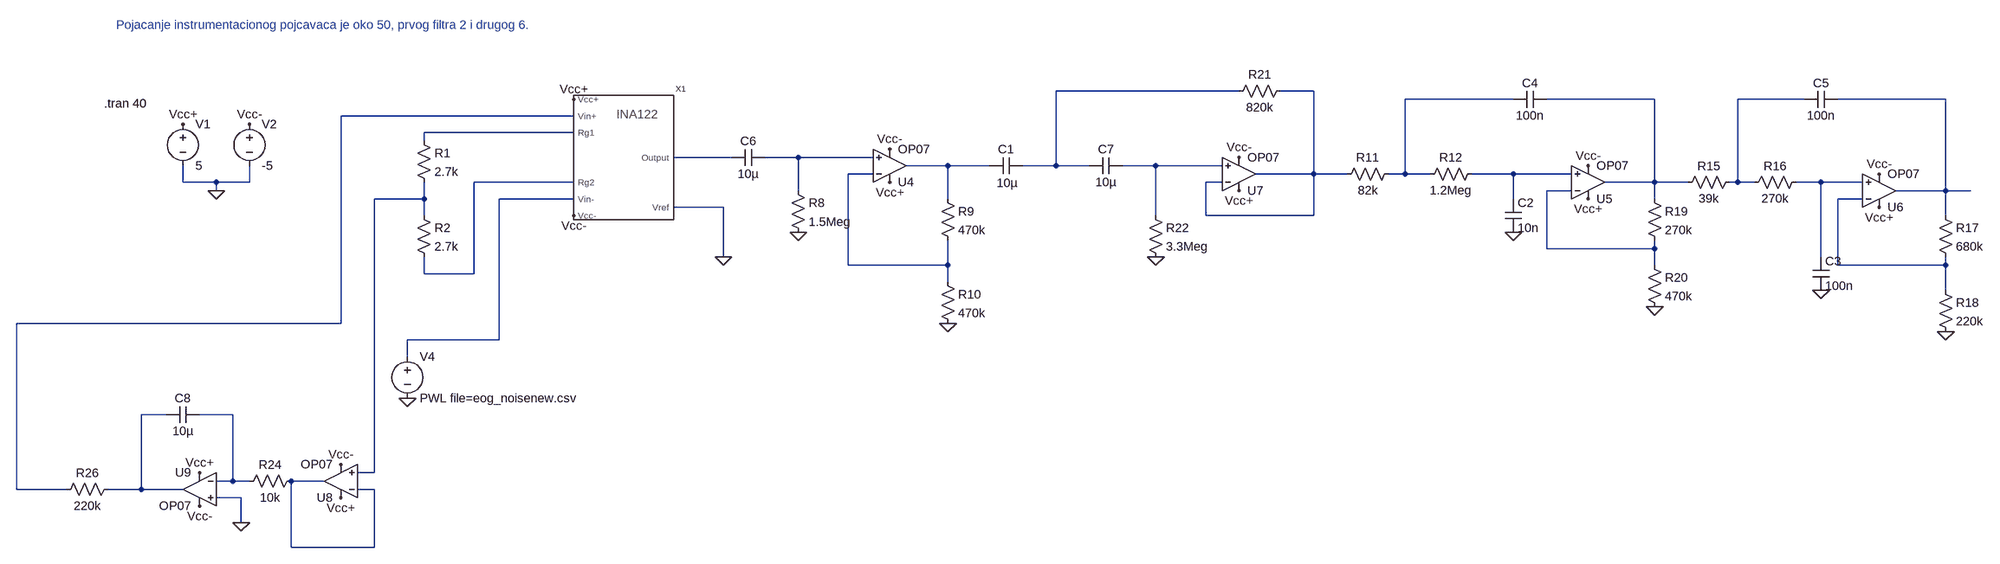
[diagram p0: schematic finalna_sema.asc]
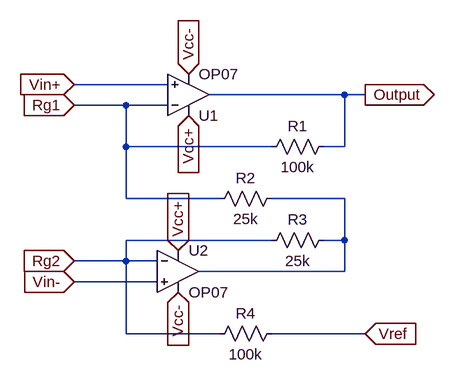
[diagram p1: sub-circuit ina122.asc]
finalna_sema.asc, the LTspice schematic file:
Version 4
SHEET 1 3168 1024
WIRE 1728 128 1376 128
WIRE 1872 128 1808 128
WIRE 2256 144 2048 144
WIRE 2528 144 2320 144
WIRE 2816 144 2688 144
WIRE 3088 144 2880 144
WIRE 448 176 0 176
WIRE 448 208 160 208
WIRE 160 224 160 208
WIRE 752 256 640 256
WIRE 880 256 816 256
WIRE 1024 256 880 256
WIRE 1168 272 1088 272
WIRE 1248 272 1168 272
WIRE 1376 272 1376 128
WIRE 1376 272 1312 272
WIRE 1440 272 1376 272
WIRE 1568 272 1504 272
WIRE 1696 272 1568 272
WIRE 1024 288 976 288
WIRE 1872 288 1872 128
WIRE 1872 288 1760 288
WIRE 1936 288 1872 288
WIRE 2048 288 2048 144
WIRE 2048 288 2016 288
WIRE 2096 288 2048 288
WIRE 2256 288 2176 288
WIRE 2368 288 2256 288
WIRE -304 304 -304 272
WIRE -240 304 -304 304
WIRE -176 304 -176 272
WIRE -176 304 -240 304
WIRE 448 304 256 304
WIRE 1696 304 1664 304
WIRE 2528 304 2528 144
WIRE 2528 304 2432 304
WIRE 2592 304 2528 304
WIRE 2688 304 2688 144
WIRE 2688 304 2672 304
WIRE 2720 304 2688 304
WIRE 2848 304 2800 304
WIRE 2928 304 2848 304
WIRE -240 320 -240 304
WIRE 880 320 880 256
WIRE 2368 320 2320 320
WIRE 3088 320 3088 144
WIRE 3088 320 2992 320
WIRE 3136 320 3088 320
WIRE 160 336 160 304
WIRE 160 336 64 336
WIRE 448 336 304 336
WIRE 1168 336 1168 272
WIRE 2256 336 2256 288
WIRE 2528 336 2528 304
WIRE 2928 336 2880 336
WIRE 736 352 640 352
WIRE 160 368 160 336
WIRE 1568 368 1568 272
WIRE 1664 368 1664 304
WIRE 1872 368 1872 288
WIRE 1872 368 1664 368
WIRE 3088 368 3088 320
WIRE 2320 432 2320 320
WIRE 2528 432 2528 416
WIRE 2528 432 2320 432
WIRE 736 448 736 352
WIRE 2848 448 2848 304
WIRE 976 464 976 288
WIRE 1168 464 1168 416
WIRE 1168 464 976 464
WIRE 2528 464 2528 432
WIRE 2880 464 2880 336
WIRE 3088 464 3088 448
WIRE 3088 464 2880 464
WIRE 160 480 160 448
WIRE 256 480 256 304
WIRE 256 480 160 480
WIRE 1168 496 1168 464
WIRE 3088 512 3088 464
WIRE 0 576 0 176
WIRE 0 576 -624 576
WIRE 304 608 304 336
WIRE 304 608 128 608
WIRE 128 640 128 608
WIRE -336 752 -384 752
WIRE -208 752 -272 752
WIRE 64 864 64 336
WIRE 64 864 32 864
WIRE -208 880 -208 752
WIRE -208 880 -240 880
WIRE -176 880 -208 880
WIRE -32 880 -96 880
WIRE -624 896 -624 576
WIRE -528 896 -624 896
WIRE -384 896 -384 752
WIRE -384 896 -448 896
WIRE -304 896 -384 896
WIRE 64 896 32 896
WIRE -192 912 -240 912
WIRE -192 960 -192 912
WIRE -96 1008 -96 880
WIRE 64 1008 64 896
WIRE 64 1008 -96 1008
FLAG -240 320 0
FLAG -304 192 Vcc+
FLAG -176 192 Vcc-
FLAG 1056 304 Vcc+
FLAG 1056 240 Vcc-
FLAG 2400 336 Vcc+
FLAG 2400 272 Vcc-
FLAG 880 400 0
FLAG 1168 576 0
FLAG 2256 400 0
FLAG 2848 512 0
FLAG 3088 592 0
FLAG 2528 544 0
FLAG 2960 352 Vcc+
FLAG 2960 288 Vcc-
FLAG 1568 448 0
FLAG 1728 320 Vcc+
FLAG 1728 256 Vcc-
FLAG -192 960 0
FLAG 0 912 Vcc+
FLAG -272 864 Vcc+
FLAG 0 848 Vcc-
FLAG -272 928 Vcc-
FLAG 128 720 0
FLAG 736 448 0
FLAG 448 144 Vcc+
FLAG 448 368 Vcc-
SYMBOL voltage -304 176 R0
WINDOW 123 0 0 Left 0
WINDOW 39 0 0 Left 0
SYMATTR InstName V1
SYMATTR Value 5
SYMBOL voltage -176 176 R0
WINDOW 123 0 0 Left 0
WINDOW 39 0 0 Left 0
SYMATTR InstName V2
SYMATTR Value -5
SYMBOL voltage 128 624 R0
WINDOW 123 0 0 Left 0
WINDOW 39 0 0 Left 0
SYMATTR InstName V4
SYMATTR Value PWL file=eog_noisenew.csv
SYMBOL OpAmps\\OP07 1056 336 M180
SYMATTR InstName U4
SYMBOL OpAmps\\OP07 2400 368 M180
SYMATTR InstName U5
SYMBOL cap 1312 256 R90
WINDOW 0 0 32 VBottom 2
WINDOW 3 34 30 VTop 2
SYMATTR InstName C1
SYMATTR Value 10µ
SYMBOL res 864 304 R0
SYMATTR InstName R8
SYMATTR Value 1.5Meg
SYMBOL res 1152 320 R0
SYMATTR InstName R9
SYMATTR Value 470k
SYMBOL res 1152 480 R0
SYMATTR InstName R10
SYMATTR Value 470k
SYMBOL OpAmps\\OP07 2960 384 M180
SYMATTR InstName U6
SYMBOL cap 2240 336 R0
SYMATTR InstName C2
SYMATTR Value 10n
SYMBOL cap 2832 448 R0
SYMATTR InstName C3
SYMATTR Value 100n
SYMBOL cap 2320 128 R90
WINDOW 0 0 32 VBottom 2
WINDOW 3 32 32 VTop 2
SYMATTR InstName C4
SYMATTR Value 100n
SYMBOL cap 2880 128 R90
WINDOW 0 0 32 VBottom 2
WINDOW 3 32 32 VTop 2
SYMATTR InstName C5
SYMATTR Value 100n
SYMBOL res 2032 272 R90
WINDOW 0 0 56 VBottom 2
WINDOW 3 32 56 VTop 2
SYMATTR InstName R11
SYMATTR Value 82k
SYMBOL res 2192 272 R90
WINDOW 0 0 56 VBottom 2
WINDOW 3 32 56 VTop 2
SYMATTR InstName R12
SYMATTR Value 1.2Meg
SYMBOL res 2688 288 R90
WINDOW 0 0 56 VBottom 2
WINDOW 3 32 56 VTop 2
SYMATTR InstName R15
SYMATTR Value 39k
SYMBOL res 2816 288 R90
WINDOW 0 0 56 VBottom 2
WINDOW 3 32 56 VTop 2
SYMATTR InstName R16
SYMATTR Value 270k
SYMBOL res 3072 352 R0
SYMATTR InstName R17
SYMATTR Value 680k
SYMBOL res 3072 496 R0
SYMATTR InstName R18
SYMATTR Value 220k
SYMBOL res 2512 320 R0
SYMATTR InstName R19
SYMATTR Value 270k
SYMBOL res 2512 448 R0
SYMATTR InstName R20
SYMATTR Value 470k
SYMBOL cap 816 240 R90
WINDOW 0 0 32 VBottom 2
WINDOW 3 32 32 VTop 2
SYMATTR InstName C6
SYMATTR Value 10µ
SYMBOL res 1824 112 R90
WINDOW 0 0 56 VBottom 2
WINDOW 3 32 56 VTop 2
SYMATTR InstName R21
SYMATTR Value 820k
SYMBOL cap 1504 256 R90
WINDOW 0 0 32 VBottom 2
WINDOW 3 32 32 VTop 2
SYMATTR InstName C7
SYMATTR Value 10µ
SYMBOL res 1552 352 R0
SYMATTR InstName R22
SYMATTR Value 3.3Meg
SYMBOL OpAmps\\OP07 1728 352 M180
SYMATTR InstName U7
SYMBOL OpAmps\\OP07 0 944 R180
SYMATTR InstName U8
SYMBOL OpAmps\\OP07 -272 832 M0
SYMATTR InstName U9
SYMBOL res -80 864 R90
WINDOW 0 0 56 VBottom 2
WINDOW 3 32 56 VTop 2
SYMATTR InstName R24
SYMATTR Value 10k
SYMBOL res -432 880 R90
WINDOW 0 0 56 VBottom 2
WINDOW 3 32 56 VTop 2
SYMATTR InstName R26
SYMATTR Value 220k
SYMBOL cap -272 736 R90
WINDOW 0 0 32 VBottom 2
WINDOW 3 32 32 VTop 2
SYMATTR InstName C8
SYMATTR Value 10µ
SYMBOL ina122 544 256 R0
SYMATTR InstName X1
SYMBOL res 144 208 R0
SYMATTR InstName R1
SYMATTR Value 2.7k
SYMBOL res 144 352 R0
SYMATTR InstName R2
SYMATTR Value 2.7k
TEXT -456 152 Left 2 !.tran 40
TEXT -432 0 Left 2 ;Pojacanje instrumentacionog pojcavaca je oko 50, prvog filtra 2 i drugog 6.

ina122.asc, the sub-circuit schematic file:
Version 4
SHEET 1 880 680
WIRE 160 112 16 112
WIRE 432 128 224 128
WIRE 464 128 432 128
WIRE 96 144 16 144
WIRE 160 144 96 144
WIRE 96 208 96 144
WIRE 320 208 96 208
WIRE 432 208 432 128
WIRE 432 208 400 208
WIRE 96 288 96 208
WIRE 240 288 96 288
WIRE 432 288 320 288
WIRE 320 352 96 352
WIRE 432 352 432 288
WIRE 432 352 400 352
WIRE 96 384 96 352
WIRE 96 384 16 384
WIRE 144 384 96 384
WIRE 432 400 432 352
WIRE 432 400 208 400
WIRE 144 416 16 416
WIRE 96 496 96 384
WIRE 240 496 96 496
WIRE 464 496 320 496
FLAG 464 128 Output
IOPIN 464 128 Out
FLAG 464 496 Vref
IOPIN 464 496 In
FLAG 16 144 Rg1
IOPIN 16 144 In
FLAG 16 384 Rg2
IOPIN 16 384 In
FLAG 16 112 Vin+
IOPIN 16 112 In
FLAG 16 416 Vin-
IOPIN 16 416 In
FLAG 192 160 Vcc+
IOPIN 192 160 In
FLAG 176 368 Vcc+
IOPIN 176 368 In
FLAG 192 96 Vcc-
IOPIN 192 96 In
FLAG 176 432 Vcc-
IOPIN 176 432 In
SYMBOL OpAmps\\OP07 192 192 M180
SYMATTR InstName U1
SYMBOL OpAmps\\OP07 176 336 R0
SYMATTR InstName U2
SYMBOL res 416 192 R90
WINDOW 0 0 56 VBottom 2
WINDOW 3 32 56 VTop 2
SYMATTR InstName R1
SYMATTR Value 100k
SYMBOL res 336 272 R90
WINDOW 0 0 56 VBottom 2
WINDOW 3 32 56 VTop 2
SYMATTR InstName R2
SYMATTR Value 25k
SYMBOL res 416 336 R90
WINDOW 0 0 56 VBottom 2
WINDOW 3 32 56 VTop 2
SYMATTR InstName R3
SYMATTR Value 25k
SYMBOL res 336 480 R90
WINDOW 0 0 56 VBottom 2
WINDOW 3 32 56 VTop 2
SYMATTR InstName R4
SYMATTR Value 100k

The netlist it stands for:
* finalna_sema.asc
V1 Vcc+ 0 5
V2 Vcc- 0 -5
V4 N019 0 PWL file=eog_noisenew.csv
XU4 N010 N013 Vcc+ Vcc- N011 LT1001  ; OP07, pins In+ In- V+ V- OUT
XU5 N014 N017 Vcc+ Vcc- N004 LT1001  ; OP07, pins In+ In- V+ V- OUT
C1 N001 N011 10µ
R8 N010 0 1.5Meg
R9 N011 N013 470k
R10 N013 0 470k
XU6 N016 N020 Vcc+ Vcc- N006 LT1001  ; OP07, pins In+ In- V+ V- OUT
C2 N014 0 10n
C3 N016 0 100n
C4 N004 N003 100n
C5 N006 N005 100n
R11 N003 N002 82k
R12 N014 N003 1.2Meg
R15 N005 N004 39k
R16 N016 N005 270k
R17 N006 N020 680k
R18 N020 0 220k
R19 N004 N017 270k
R20 N017 0 470k
C6 N010 N009 10µ
R21 N002 N001 820k
C7 N012 N001 10µ
R22 N012 0 3.3Meg
XU7 N012 N002 Vcc+ Vcc- N002 LT1001  ; OP07, pins In+ In- V+ V- OUT
XU8 N018 N023 Vcc+ Vcc- N023 LT1001  ; OP07, pins In+ In- V+ V- OUT
XU9 0 N022 Vcc+ Vcc- N021 LT1001  ; OP07, pins In+ In- V+ V- OUT
R24 N023 N022 10k
R26 N021 N007 220k
C8 N022 N021 10µ
XX1 N008 N015 Vcc+ Vcc- N007 N019 0 N009 ina122
R1 N008 N018 2.7k
R2 N018 N015 2.7k

* block symbol definitions
.subckt ina122 Rg1 Rg2 Vcc+ Vcc- Vin+ Vin- Vref Output
XU1 Vin+ Rg1 Vcc+ Vcc- Output LT1001  ; OP07, pins In+ In- V+ V- OUT
XU2 Vin- Rg2 Vcc+ Vcc- N001 LT1001  ; OP07, pins In+ In- V+ V- OUT
R1 Output Rg1 100k
R2 N001 Rg1 25k
R3 N001 Rg2 25k
R4 Vref Rg2 100k
.ends ina122

.tran 40
* Pojacanje instrumentacionog pojcavaca je oko 50, prvog filtra 2 i drugog 6.
.lib LTC.lib
.backanno
.end